# EAGLE design farbsort (EAGLE 7.6.0)
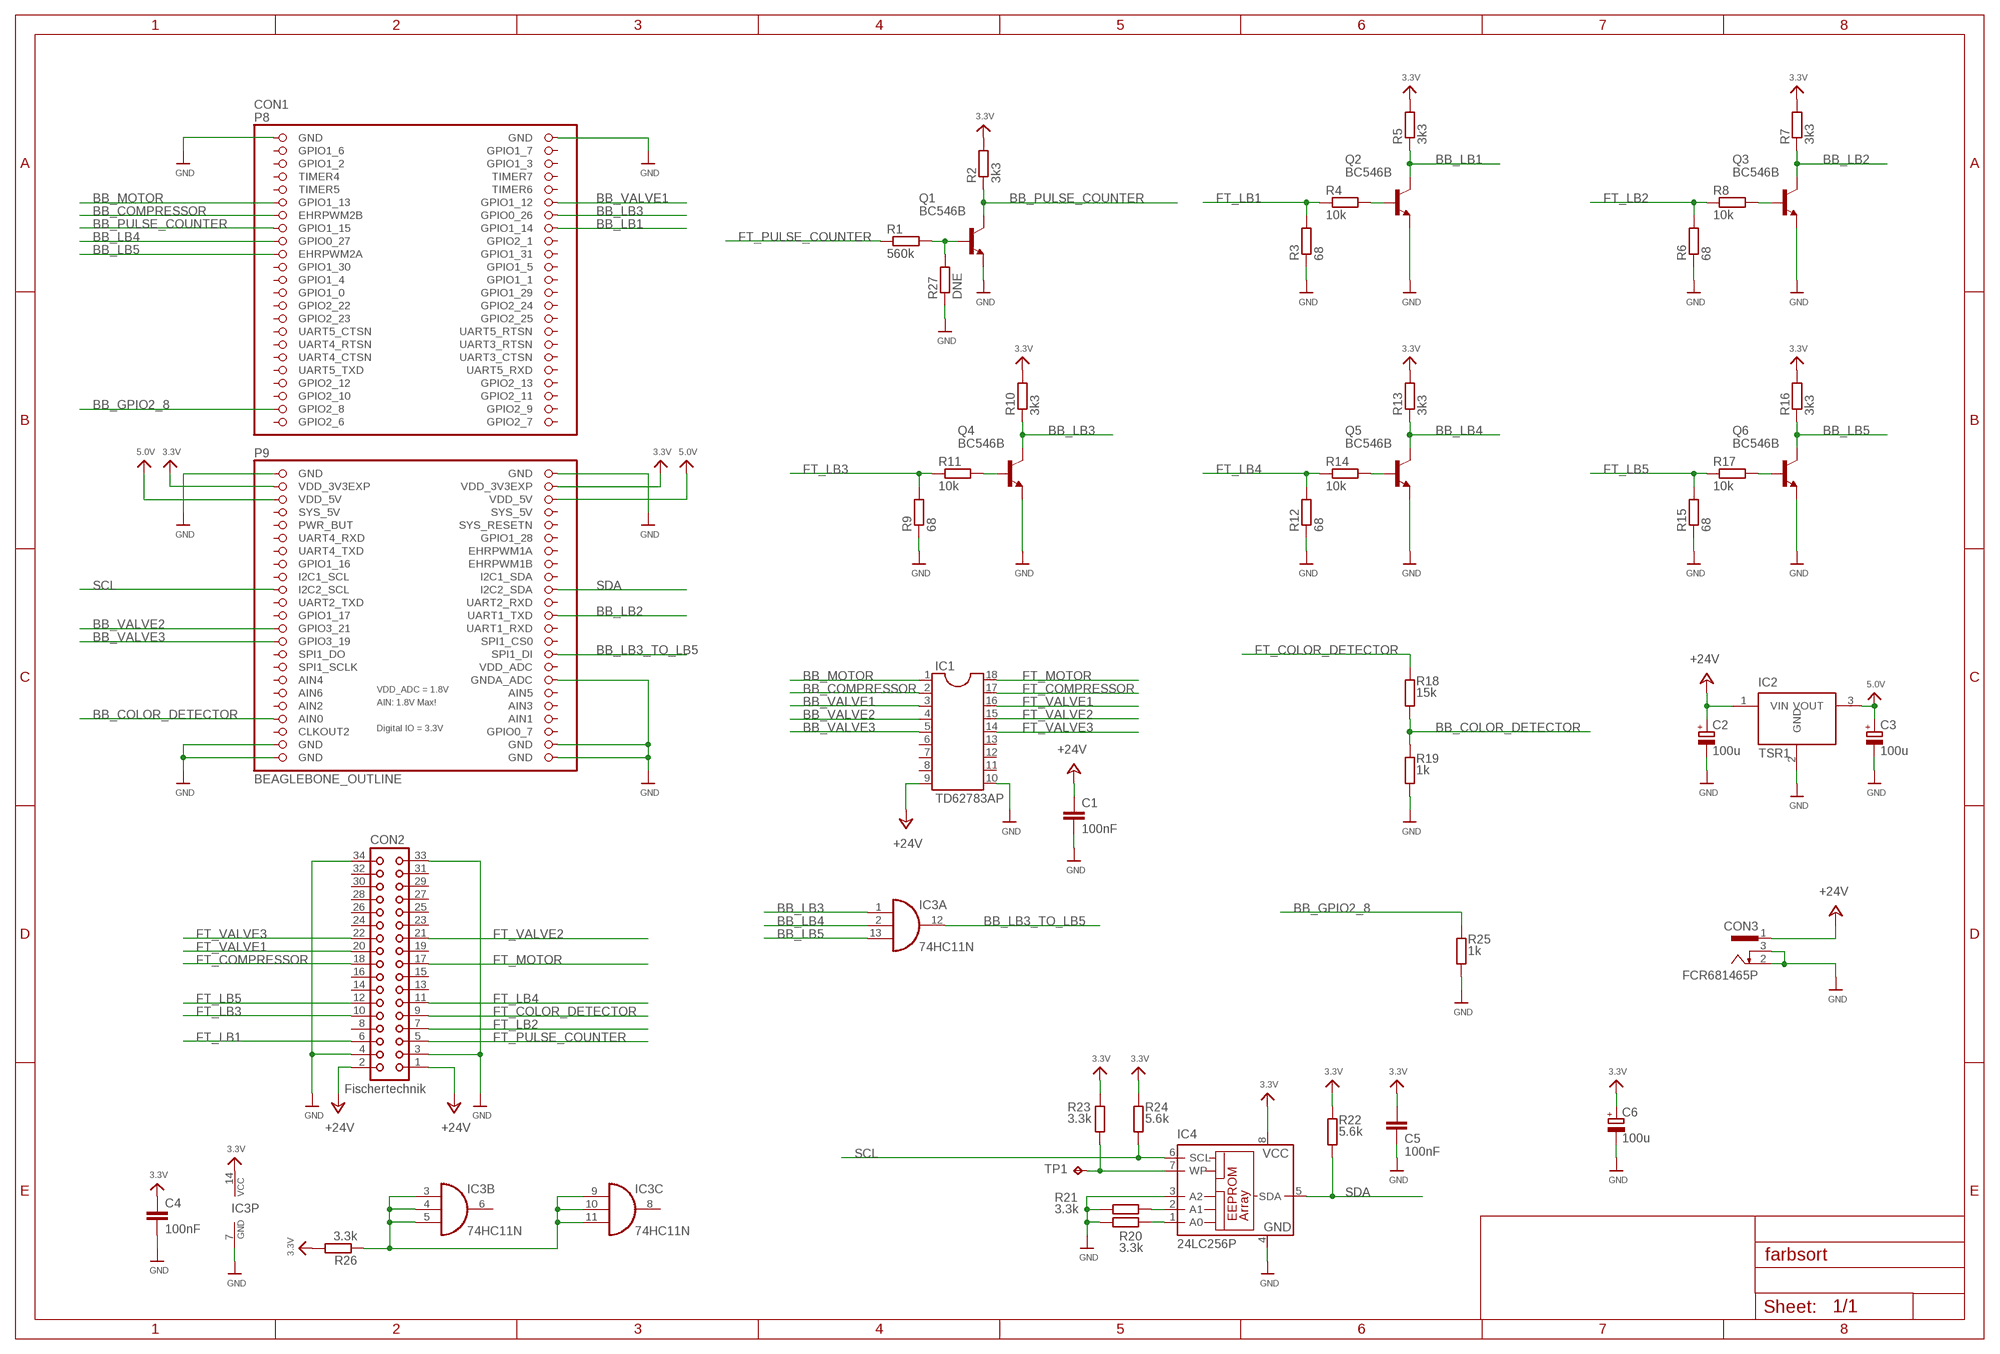
[diagram p0: schematic, sheet 1]

## Parts
C1  100nF  C-EU025-024X044  [C025-024X044]
C2  100u  CPOL-EUB45181B  [B45181B]
C3  100u  CPOL-EUB45181B  [B45181B]
C4  100nF  C-EU025-024X044  [C025-024X044]
C5  100nF  C-EU025-024X044  [C025-024X044]
C6  100u  CPOL-EUB45181B  [B45181B]
CON1  BEAGLEBONE_OUTLINE  [BEAGLEBONE_SHIELD]
CON2  Fischertechnik  CON34  [CON34]
CON3  FCR681465P  SCD-014A  [SCD-014-A]
IC1  TD62783AP  DIL18  [DIL18]
IC2  TSR1  [TSR1]
IC3  74HC11N  [DIL14]
IC4  24LC256P  [DIL8]
Q1  BC546B  [TO92-EBC]
Q2  BC546B  [TO92-EBC]
Q3  BC546B  [TO92-EBC]
Q4  BC546B  [TO92-EBC]
Q5  BC546B  [TO92-EBC]
Q6  BC546B  [TO92-EBC]
R1  560k  R-EU_0204/2V  [0204V]
R2  3k3  R-EU_0204/2V  [0204V]
R3  68  R-EU_0204/2V  [0204V]
R4  10k  R-EU_0204/2V  [0204V]
R5  3k3  R-EU_0204/2V  [0204V]
R6  68  R-EU_0204/2V  [0204V]
R7  3k3  R-EU_0204/2V  [0204V]
R8  10k  R-EU_0204/2V  [0204V]
R9  68  R-EU_0204/2V  [0204V]
R10  3k3  R-EU_0204/2V  [0204V]
R11  10k  R-EU_0204/2V  [0204V]
R12  68  R-EU_0204/2V  [0204V]
R13  3k3  R-EU_0204/2V  [0204V]
R14  10k  R-EU_0204/2V  [0204V]
R15  68  R-EU_0204/2V  [0204V]
R16  3k3  R-EU_0204/2V  [0204V]
R17  10k  R-EU_0204/2V  [0204V]
R18  15k  R-EU_0204/2V  [0204V]
R19  1k  R-EU_0204/2V  [0204V]
R20  3.3k  R-EU_0204/2V  [0204V]
R21  3.3k  R-EU_0204/2V  [0204V]
R22  5.6k  R-EU_0204/2V  [0204V]
R23  3.3k  R-EU_0204/2V  [0204V]
R24  5.6k  R-EU_0204/2V  [0204V]
R25  1k  R-EU_0204/2V  [0204V]
R26  3.3k  R-EU_0204/2V  [0204V]
R27  DNE  R-EU_0204/2V  [0204V]
TP1  TPB1,27  [B1,27]

## Nets
3.3V: C4.1 C5.1 C6.+ CON1.49(VDD_3V3EXP) CON1.50(VDD_3V3EXP) IC3.14(P:VCC) IC4.8(VCC) R2.2 R5.2 R7.2 R10.2 R13.2 R16.2 R22.1 R23.1 R24.1 R26.2
5.0V: C3.+ CON1.51(VDD_5V) CON1.52(VDD_5V) IC2.3(VOUT)
+24V: C1.1 C2.+ CON2.1 CON2.2 CON3.1 IC1.9 IC2.1(VIN)
BB_COLOR_DETECTOR: CON1.85(AIN0) R18.2 R19.1
BB_COMPRESSOR: CON1.13(EHRPWM2B) IC1.2
BB_GPIO2_8: CON1.43(GPIO2_8) R25.1
BB_LB1: CON1.16(GPIO1_14) Q2.C R5.1
BB_LB2: CON1.70(UART1_TXD) Q3.C R7.1
BB_LB3: CON1.14(GPIO0_26) IC3.1(A:I0) Q4.C R10.1
BB_LB3_TO_LB5: CON1.76(SPI1_DI) IC3.12(A:O)
BB_LB4: CON1.17(GPIO0_27) IC3.2(A:I1) Q5.C R13.1
BB_LB5: CON1.19(EHRPWM2A) IC3.13(A:I2) Q6.C R16.1
BB_MOTOR: CON1.11(GPIO1_13) IC1.1
BB_PULSE_COUNTER: CON1.15(GPIO1_15) Q1.C R2.1
BB_VALVE1: CON1.12(GPIO1_12) IC1.3
BB_VALVE2: CON1.71(GPIO3_21) IC1.4
BB_VALVE3: CON1.73(GPIO3_19) IC1.5
FT_COLOR_DETECTOR: CON2.9 R18.1
FT_COMPRESSOR: CON2.18 IC1.17
FT_LB1: CON2.6 R3.2 R4.1
FT_LB2: CON2.7 R6.2 R8.1
FT_LB3: CON2.10 R9.2 R11.1
FT_LB4: CON2.11 R12.2 R14.1
FT_LB5: CON2.12 R15.2 R17.1
FT_MOTOR: CON2.17 IC1.18
FT_PULSE_COUNTER: CON2.5 R1.1
FT_VALVE1: CON2.20 IC1.16
FT_VALVE2: CON2.21 IC1.15
FT_VALVE3: CON2.22 IC1.14
GND: C1.2 C2.- C3.- C4.2 C5.2 C6.- CON1.1(GND) CON1.2(GND) CON1.47(GND) CON1.48(GND) CON1.80(GNDA_ADC) CON1.89(GND) CON1.90(GND) CON1.91(GND) CON1.92(GND) CON2.3 CON2.4 CON2.33 CON2.34 CON3.2 CON3.3 IC1.10 IC2.2(GND) IC3.7(P:GND) IC4.3(A2) IC4.4(GND) Q1.E Q2.E Q3.E Q4.E Q5.E Q6.E R3.1 R6.1 R9.1 R12.1 R15.1 R19.2 R20.1 R21.1 R25.2 R27.1
N$1: Q1.B R1.2 R27.2
N$2: IC3.3(B:I0) IC3.4(B:I1) IC3.5(B:I2) IC3.9(C:I0) IC3.10(C:I1) IC3.11(C:I2) R26.1
N$3: Q2.B R4.2
N$6: IC4.7(WP) R23.2 TP1.TP
N$8: Q3.B R8.2
N$10: IC4.2(A1) R21.2
N$11: IC4.1(A0) R20.2
N$12: Q4.B R11.2
N$16: Q5.B R14.2
N$20: Q6.B R17.2
SCL: CON1.65(I2C2_SCL) IC4.6(SCL) R24.2
SDA: CON1.66(I2C2_SDA) IC4.5(SDA) R22.2
Unconnected: CON1.3(GPIO1_6) CON1.4(GPIO1_7) CON1.5(GPIO1_2) CON1.6(GPIO1_3) CON1.7(TIMER4) CON1.8(TIMER7) CON1.9(TIMER5) CON1.10(TIMER6) CON1.18(GPIO2_1) CON1.20(GPIO1_31) CON1.21(GPIO1_30) CON1.22(GPIO1_5) CON1.23(GPIO1_4) CON1.24(GPIO1_1) CON1.25(GPIO1_0) CON1.26(GPIO1_29) CON1.27(GPIO2_22) CON1.28(GPIO2_24) CON1.29(GPIO2_23) CON1.30(GPIO2_25) CON1.31(UART5_CTSN) CON1.32(UART5_RTSN) CON1.33(UART4_RTSN) CON1.34(UART3_RTSN) CON1.35(UART4_CTSN) CON1.36(UART3_CTSN) CON1.37(UART5_TXD) CON1.38(UART5_RXD) CON1.39(GPIO2_12) CON1.40(GPIO2_13) CON1.41(GPIO2_10) CON1.42(GPIO2_11) CON1.44(GPIO2_9) CON1.45(GPIO2_6) CON1.46(GPIO2_7) CON1.55(PWR_BUT) CON1.56(SYS_RESETN) CON1.57(UART4_RXD) CON1.58(GPIO1_28) CON1.59(UART4_TXD) CON1.60(EHRPWM1A) CON1.61(GPIO1_16) CON1.62(EHRPWM1B) CON1.63(I2C1_SCL) CON1.64(I2C1_SDA) CON1.67(UART2_TXD) CON1.68(UART2_RXD) CON1.69(GPIO1_17) CON1.72(UART1_RXD) CON1.74(SPI1_CS0) CON1.75(SPI1_DO) CON1.77(SPI1_SCLK) CON1.79(AIN4) CON1.81(AIN6) CON1.82(AIN5) CON1.83(AIN2) CON1.84(AIN3) CON1.86(AIN1) CON1.87(CLKOUT2) CON1.88(GPIO0_7) CON2.8 CON2.13 CON2.14 CON2.15 CON2.16 CON2.19 CON2.23 CON2.24 CON2.25 CON2.26 CON2.27 CON2.28 CON2.29 CON2.30 CON2.31 CON2.32 IC1.6 IC1.7 IC1.8 IC1.11 IC1.12 IC1.13 IC3.6(B:O) IC3.8(C:O)

## Power pins joined to a net without a drawn wire
SYS_5V: CON1.53(SYS_5V) CON1.54(SYS_5V)
VDD_ADC: CON1.78(VDD_ADC)

## Library data of the parts
C1 C4 C5 = resistor:C-EU: CAPACITOR, European symbol
C2 C3 C6 = resistor:CPOL-EU: POLARIZED CAPACITOR, European symbol
CON1 = microbuilder:BEAGLEBONE_OUTLINE
CON2 = con-harting:CON34: CONNECTOR; OC_FARNELL: unknown; OC_NEWARK: unknown
CON3 = con-shiua-chyuan:SCD-014A: Power Jack 2.5mm; OC_FARNELL: unknown; OC_NEWARK: unknown
IC1 = ic-package:DIL18: Dual In Line / Socket
IC2 = traco-electronic:TSR1: DC/DC Converter TSR-1 Series, 1A Source: Distrelec
IC3 = 74xx-eu:74*11: Triple 3-input AND gate
IC4 = microchip:24*: Serial EEPROM I2C; MF: MICROCHIP; MPN: 24LC256-E/P; OC_FARNELL: 9757970; OC_NEWARK: 92C7169
Q1-Q6 = transistor-npn:BC546*: NPN Transistor
R1-R27 = rcl:R-EU_: RESISTOR, European symbol
TP1 = testpad:TP: Test pad

## Board
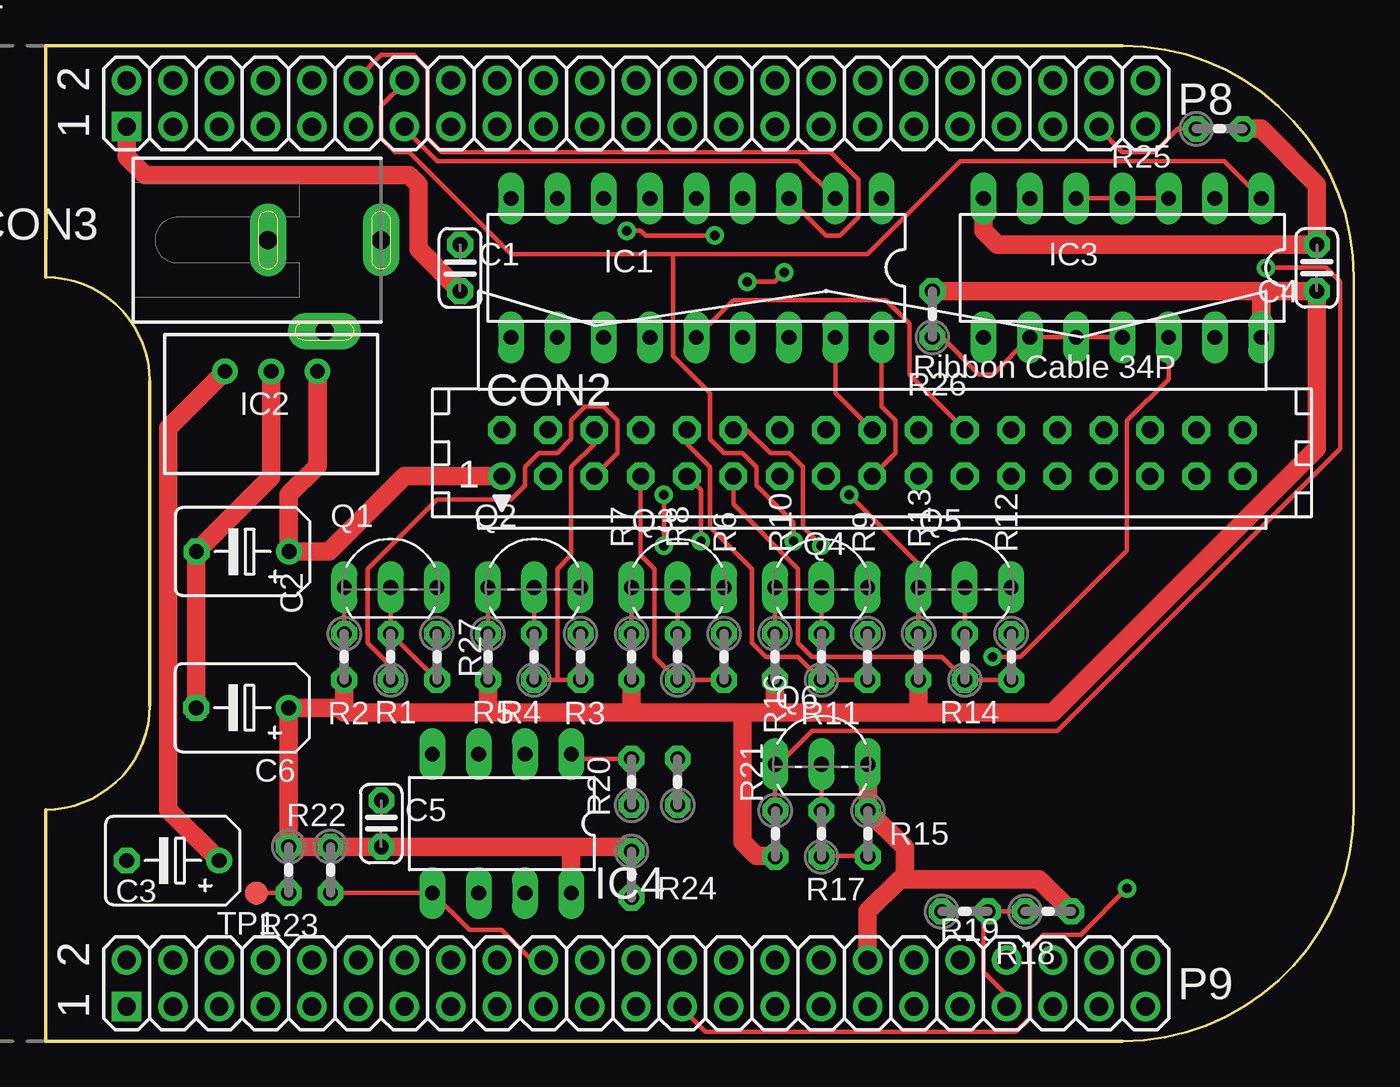
[diagram p1: board, top side]
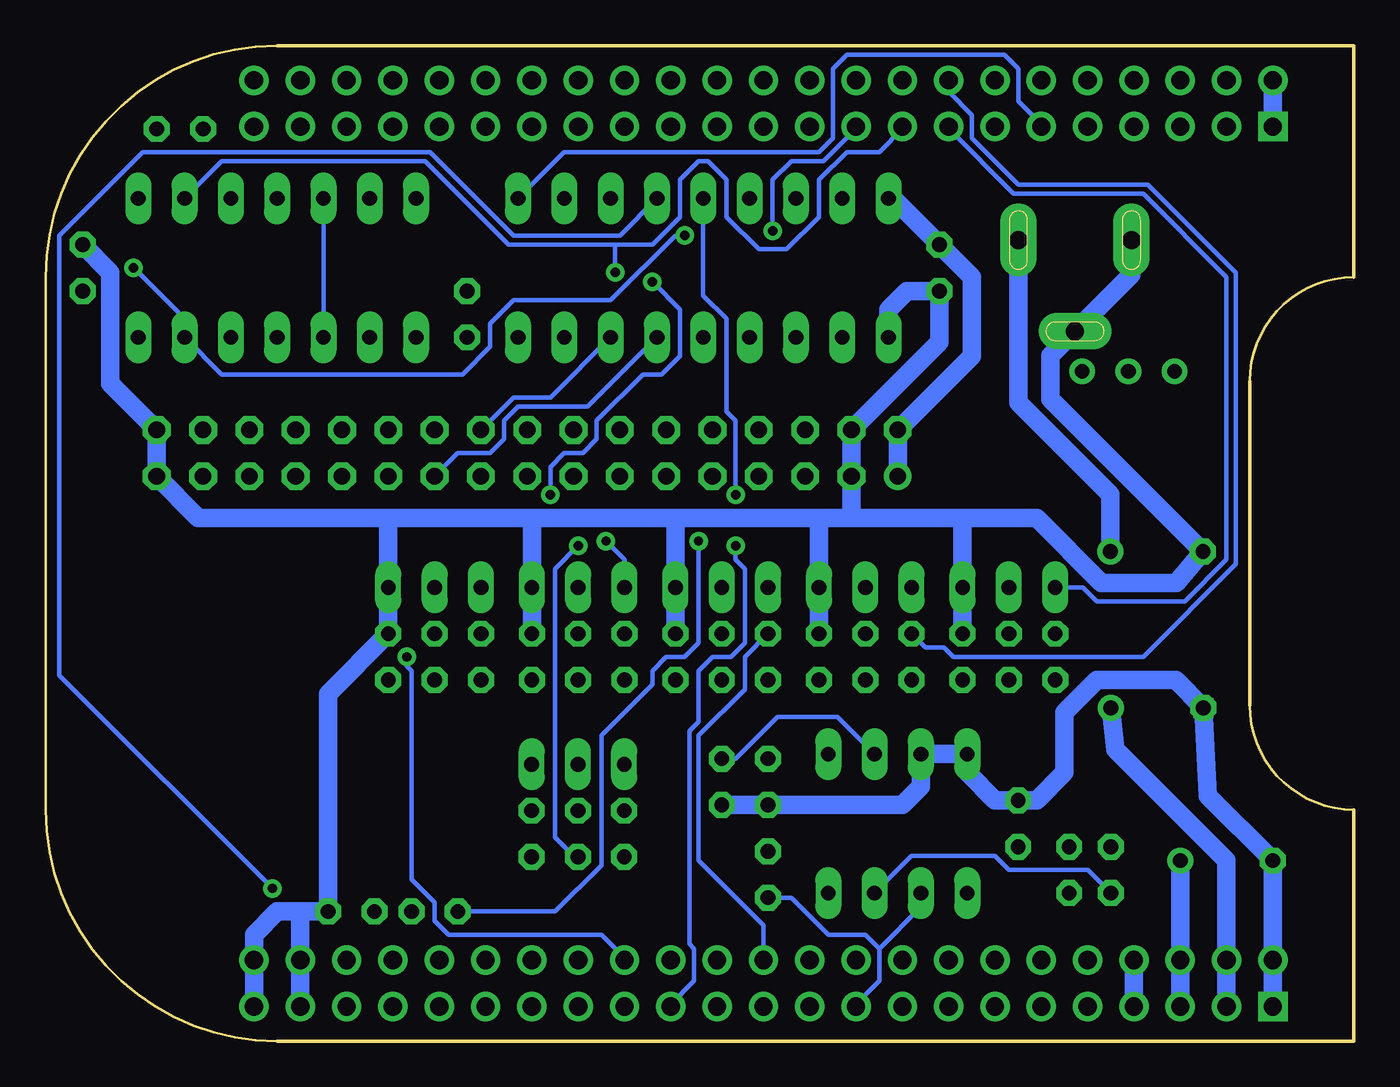
[diagram p2: board, bottom side, seen from below]

Size 71.75 x 54.61 mm. Coordinates in mm from the lower left corner, seen from the top.
Copper layers (1*16): Top 0.035mm / dielectric 1.5mm / Bottom 0.035mm
Design rules "SparkFun10mil *": minimum track width 10mil, minimum drill 20mil, track to track 10mil, track to pad 10mil, pad to pad 10mil, via to via 10mil, smd to smd 10mil, copper to edge 10mil, drill to drill 10mil, minimum pad ring 12mil, minimum via ring 10mil, stop-mask expansion 4mil, vias tented up to drill 12mil, thermal gap 10mil

### Footprints (pad centres in the part's own frame; a part is rotated, then mirrored left to right if it is on the bottom)
C025-024X044 = drill 0.813 octagon: 1 -1.27,0; 2 1.27,0
B45181B = drill 0.813: + -2.54,0 | drill 0.813 octagon: - 2.54,0
BEAGLEBONE_SHIELD = drill 1 square: 1 4.445,19.05; 47 52.705,19.05 | drill 1: 2 1.905,19.05; 3 4.445,21.59; 4 1.905,21.59; 5 4.445,24.13; 6 1.905,24.13; 7 4.445,26.67; 8 1.905,26.67; 9 4.445,29.21; 10 1.905,29.21; 11 4.445,31.75; 12 1.905,31.75; 13 4.445,34.29; 14 1.905,34.29; 15 4.445,36.83; 16 1.905,36.83; 17 4.445,39.37; 18 1.905,39.37; 19 4.445,41.91; 20 1.905,41.91; 21 4.445,44.45; 22 1.905,44.45; 23 4.445,46.99; 24 1.905,46.99; 25 4.445,49.53; 26 1.905,49.53; 27 4.445,52.07; 28 1.905,52.07; 29 4.445,54.61; 30 1.905,54.61; 31 4.445,57.15; 32 1.905,57.15; 33 4.445,59.69; 34 1.905,59.69; 35 4.445,62.23; 36 1.905,62.23; 37 4.445,64.77; 38 1.905,64.77; 39 4.445,67.31; 40 1.905,67.31; 41 4.445,69.85; 42 1.905,69.85; 43 4.445,72.39; 44 1.905,72.39; 45 4.445,74.93; 46 1.905,74.93; 48 50.165,19.05; 49 52.705,21.59; 50 50.165,21.59; 51 52.705,24.13; 52 50.165,24.13; 53 52.705,26.67; 54 50.165,26.67; 55 52.705,29.21; 56 50.165,29.21; 57 52.705,31.75; 58 50.165,31.75; 59 52.705,34.29; 60 50.165,34.29; 61 52.705,36.83; 62 50.165,36.83; 63 52.705,39.37; 64 50.165,39.37; 65 52.705,41.91; 66 50.165,41.91; 67 52.705,44.45; 68 50.165,44.45; 69 52.705,46.99; 70 50.165,46.99; 71 52.705,49.53; 72 50.165,49.53; 73 52.705,52.07; 74 50.165,52.07; 75 52.705,54.61; 76 50.165,54.61; 77 52.705,57.15; 78 50.165,57.15; 79 52.705,59.69; 80 50.165,59.69; 81 52.705,62.23; 82 50.165,62.23; 83 52.705,64.77; 84 50.165,64.77; 85 52.705,67.31; 86 50.165,67.31; 87 52.705,69.85; 88 50.165,69.85; 89 52.705,72.39; 90 50.165,72.39; 91 52.705,74.93; 92 50.165,74.93
CON34 = drill 0.914: 1 -20.32,-1.27 | drill 0.914 octagon: 2 -20.32,1.27; 3 -17.78,-1.27; 4 -17.78,1.27; 5 -15.24,-1.27; 6 -15.24,1.27; 7 -12.7,-1.27; 8 -12.7,1.27; 9 -10.16,-1.27; 10 -10.16,1.27; 11 -7.62,-1.27; 12 -7.62,1.27; 13 -5.08,-1.27; 14 -5.08,1.27; 15 -2.54,-1.27; 16 -2.54,1.27; 17 0,-1.27; 18 0,1.27; 19 2.54,-1.27; 20 2.54,1.27; 21 5.08,-1.27; 22 5.08,1.27; 23 7.62,-1.27; 24 7.62,1.27; 25 10.16,-1.27; 26 10.16,1.27; 27 12.7,-1.27; 28 12.7,1.27; 29 15.24,-1.27; 30 15.24,1.27; 31 17.78,-1.27; 32 17.78,1.27; 33 20.32,-1.27; 34 20.32,1.27
SCD-014-A = drill 1 pad 2 long: 1 0,13.7; 2 0,7.5; 3 5,10.6
DIL18 = drill 0.813 long: 1 -10.16,-3.81; 2 -7.62,-3.81; 3 -5.08,-3.81; 4 -2.54,-3.81; 5 0,-3.81; 6 2.54,-3.81; 7 5.08,-3.81; 8 7.62,-3.81; 9 10.16,-3.81; 10 10.16,3.81; 11 7.62,3.81; 12 5.08,3.81; 13 2.54,3.81; 14 0,3.81; 15 -2.54,3.81; 16 -5.08,3.81; 17 -7.62,3.81; 18 -10.16,3.81
TSR1 = drill 0.8 pad 1.2: 1 0,0; 2 2.54,0; 3 5.08,0
DIL14 = drill 0.813 long: 1 -7.62,-3.81; 2 -5.08,-3.81; 3 -2.54,-3.81; 4 0,-3.81; 5 2.54,-3.81; 6 5.08,-3.81; 7 7.62,-3.81; 8 7.62,3.81; 9 5.08,3.81; 10 2.54,3.81; 11 0,3.81; 12 -2.54,3.81; 13 -5.08,3.81; 14 -7.62,3.81
DIL8 = drill 0.813 long: 1 -3.81,-3.81; 2 -1.27,-3.81; 3 1.27,-3.81; 4 3.81,-3.81; 5 3.81,3.81; 6 1.27,3.81; 7 -1.27,3.81; 8 -3.81,3.81
TO92-EBC = drill 0.813 long: B 0,-1.27; C -2.54,-1.27; E 2.54,-1.27
0204V = drill 0.813 octagon: 1 -1.27,0; 2 1.27,0
B1,27 = smd 1.27 x 1.27: TP 0,0

### Placement (x,y rotation side)
C1  22.73,42.42 270 top
C2  10.82,26.85 180 top
C3  6.98,9.91 180 top
C4  69.72,42.42 90 top
C5  18.42,11.94 90 top
C6  10.79,18.29 180 top
CON1  -14.61,54.61 270 top
CON2  45.34,32.26 0 top
CON3  4.7,43.94 270 top
IC1  35.69,42.42 180 top
IC2  14.91,36.74 180 top
IC3  59.05,42.42 180 top
IC4  25.02,11.94 180 top
Q1  18.92,26.16 0 top
Q2  26.8,26.16 0 top
Q3  34.67,26.16 0 top
Q4  42.55,26.16 0 top
Q5  50.42,26.16 0 top
Q6  42.56,16.46 0 top
R1  18.92,21.08 90 top
R2  16.38,21.08 270 top
R3  29.34,21.08 270 top
R4  26.8,21.08 90 top
R5  24.26,21.08 270 top
R6  37.21,21.08 270 top
R7  32.13,21.08 270 top
R8  34.67,21.08 90 top
R9  45.08,21.08 270 top
R10  40,21.08 270 top
R11  42.55,21.08 90 top
R12  52.96,21.08 270 top
R13  47.88,21.08 270 top
R14  50.42,21.08 90 top
R15  45.1,11.38 270 top
R16  40.02,11.38 270 top
R17  42.56,11.38 90 top
R18  50.42,7.11 0 top
R19  54.99,7.11 0 top
R20  32.13,14.22 90 top
R21  34.67,14.22 90 top
R22  15.62,9.4 270 top
R23  13.34,9.4 270 top
R24  32.13,9.14 270 top
R25  64.39,50.04 0 top
R26  48.64,39.88 90 top
R27  21.46,21.08 270 top
TP1  11.56,8.13 0 top

### Tracks (layer width: path | path; a pad name or v marks a point on that pad's centre or on a via)
3.3V
  Top 1.016: 17.65,10.67 C5.1 | R24.1 31.88,10.67 28.83,10.67 | 28.83,10.67 C5.1 | IC4.8 28.83,10.67 | R26.2 66.67,41.15 | 66.67,41.15 C4.1 69.72,32.51 55.24,18.03 47.88,18.03 | IC3.14 66.67,41.15 | C5.1 R22.1 R23.1 13.08,10.92 13.34,11.18 C6.+ 16.13,18.29 16.38,18.03 | 47.88,18.03 39.75,18.03 | 39.75,18.03 38.23,18.03 | 38.23,18.03 32.13,18.03 | 32.13,18.03 24.26,18.03 | R10.2 40,18.29 39.75,18.03 | R7.2 32.13,18.03 | R5.2 24.26,18.03 | R2.2 16.38,18.03 | R13.2 47.88,18.03 | R16.2 39.97,10.16 38.99,10.16 38.23,10.92 38.23,18.03 | 16.38,18.03 24.26,18.03
  Bottom 1.016: CON1.49 CON1.50 6.98,9.91 13.08,16 C6.+
5.0V
  Top 1.016: IC2.3 6.73,33.64 6.73,12.7 C3.+
  Bottom 1.016: CON1.51 CON1.52 C3.+
+24V
  Top 1.016: IC2.1 14.91,31.55 13.34,29.97 13.34,26.87 C2.+ | 13.17,26.92 C2.+ | CON2.1 19.68,30.99 15.55,26.85 C2.+
  Bottom 1.016: CON2.1 CON2.2 20.96,37.59 20.96,41.91 C1.1 25.27,46.23 IC1.9 | CON3.1 18.4,35.04 13.36,29.99 C2.+
BB_COLOR_DETECTOR
  Top 0.254: R19.1 R18.2 51.44,6.86 51.44,3.81 52.7,2.54 CON1.85
BB_COMPRESSOR
  Top 0.254: IC1.2 41.28,48.26 21.46,48.26 19.68,50.04 CON1.13
BB_GPIO2_8
  Top 0.254: R25.1 62.1,50.04 60.83,48.77 59.05,48.77 57.78,50.04 CON1.43
BB_LB1
  Top 0.254: Q2.C R5.1
  Bottom 0.254: CON1.16 22.22,52.07 20.96,50.8 20.96,49.53 18.42,46.99 11.3,46.99 6.48,42.16 6.48,26.16 11.56,21.08 21.97,21.08 22.48,21.59 23.5,21.59 R5.1
BB_LB2
  Top 0.254: Q3.C R7.1
  Bottom 0.254: CON1.70 32.39,6.35 35.94,9.91 35.94,16.76 33.4,19.3 33.4,21.08 R7.1
BB_LB3  (via drill 0.51)
  Top 0.254: Q4.C R10.1 | IC3.1 64.64,48.26 50.16,48.26 45.08,43.18 34.42,43.18 | 34.42,43.18 25.53,43.18 19.94,48.77 19.18,48.77 18.42,49.53 18.42,51.31 19.68,52.58 CON1.14 | v41.02,27.43 41.02,28.45 38.99,30.48 38.99,31.5 38.23,32.26 37.21,32.26 36.45,33.02 36.45,35.56 34.42,37.59 34.42,43.18
  Bottom 0.254: Q4.C 40,26.42 v41.02,27.43
BB_LB3_TO_LB5  (via drill 0.51)
  Top 0.254: IC3.12 61.59,36.32 59.31,34.04 59.31,26.92 53.47,21.08 v51.94,21.08
  Bottom 0.254: v51.94,21.08 51.94,20.57 51.69,20.32 51.69,8.89 50.42,7.62 50.42,6.6 49.66,5.84 41.28,5.84 40,4.57 CON1.76
BB_LB4  (via drill 0.51)
  Top 0.254: R13.1 Q5.C 47.88,26.16 v44.07,29.97 | v38.48,41.66 40,41.66 v40.51,42.16
  Bottom 0.254: IC3.2 62.1,48.26 50.93,48.26 46.36,43.69 40.51,43.69 | 40.51,43.69 38.48,43.69 36.96,45.21 36.96,47.24 35.94,48.26 35.43,48.26 34.42,47.24 34.42,45.21 32.64,43.43 31.11,43.43 29.34,45.21 29.34,47.24 27.81,48.77 26.04,48.77 24.76,50.04 CON1.17 | v44.07,29.97 44.07,31.5 43.31,32.26 42.29,32.26 41.53,33.02 41.53,34.04 38.99,36.58 37.97,36.58 36.96,37.59 36.96,40.13 v38.48,41.66 | 40.51,43.69 v40.51,42.16
BB_LB5  (via drill 0.51)
  Top 0.254: R16.1 40,12.7 40,14.99 Q6.C 40.26,15.24 42.04,17.02 55.5,17.02 70.99,32.51 70.99,41.66 70.23,42.42 v66.93,42.42 | v31.88,44.45 32.64,44.45 32.89,44.2 v36.7,44.2
  Bottom 0.254: v66.93,42.42 64.13,39.62 IC3.13 62.1,36.58 48.89,36.58 47.37,38.1 47.37,39.37 46.1,40.64 40.77,40.64 37.21,44.2 v36.7,44.2 | v31.88,44.45 31.88,47.24 30.86,48.26 29.08,48.26 27.3,50.04 CON1.19
BB_MOTOR
  Bottom 0.254: IC1.1 43.31,48.77 29.34,48.77 28.57,49.53 28.57,53.34 27.81,54.1 19.18,54.1 18.42,53.34 18.42,51.56 17.14,50.29 CON1.11
BB_PULSE_COUNTER
  Top 0.254: Q1.C R2.1
  Bottom 0.254: CON1.15 22.22,50.04 18.67,46.48 11.56,46.48 6.98,41.91 6.98,26.42 9.27,24.13 14.1,24.13 14.86,24.89 Q1.C
BB_VALVE1
  Top 0.254: IC1.3 42.8,44.2 43.56,44.2 44.58,45.21 44.58,47.24 43.05,48.77 21.72,48.77 20.96,49.53 20.96,53.34 20.19,54.1 18.42,54.1 17.14,52.83 CON1.12
BB_VALVE2  (via drill 0.51)
  Top 0.254: v59.31,8.38 56.77,5.84 54.74,5.84 53.97,5.08 53.97,1.27 53.21,0.51 36.19,0.51 34.92,1.78 CON1.71
  Bottom 0.254: IC1.4 40.26,44.2 46.1,44.2 50.67,48.77 66.42,48.77 70.99,44.2 70.99,20.07 v59.31,8.38
BB_VALVE3  (via drill 0.51)
  Top 0.254: v33.91,27.18 v33.91,29.97
  Bottom 0.254: IC1.5 35.69,40.89 34.42,39.62 34.42,34.54 33.91,34.04 v33.91,29.97 | v33.91,27.18 33.91,26.42 33.4,25.91 33.4,21.84 34.16,21.08 35.18,21.08 35.94,20.32 35.94,17.53 36.45,17.02 36.45,5.33 36.19,5.08 36.19,3.3 37.47,2.03 CON1.73
FT_COLOR_DETECTOR  (via drill 0.51)
  Top 0.254: v35.94,27.43 35.94,30.23 CON2.9
  Bottom 0.254: R18.1 43.81,7.11 41.28,9.65 41.28,16.76 38.48,19.56 38.48,20.32 37.72,21.08 36.7,21.08 35.94,21.84 v35.94,27.43
FT_COMPRESSOR
  Top 0.254: IC1.17 43.31,35.56 CON2.18
FT_LB1
  Top 0.254: R3.2 28.07,19.81 | 28.07,19.81 R4.1 | CON2.6 30.1,32.77 28.83,31.5 28.83,26.67 28.07,25.91 28.07,19.81
FT_LB2
  Top 0.254: R6.2 R8.1 33.4,21.08 33.4,25.91 32.64,26.67 CON2.7
FT_LB3
  Top 0.254: R9.2 R11.1 41.28,21.08 39.5,21.08 38.73,21.84 38.73,25.91 36.45,28.19 36.45,31.5 35.18,32.77 CON2.10
FT_LB4
  Top 0.254: R12.2 R14.1 49.15,21.08 42.04,21.08 41.28,21.84 41.28,25.91 37.72,29.46 CON2.11
FT_LB5  (via drill 0.51)
  Top 0.254: R17.1 42.8,10.16 45.08,10.16 R15.2 | CON2.12 38.48,33.53 39.75,32.26 40.77,32.26 41.53,31.5 41.53,28.19 v42.55,27.18
  Bottom 0.254: v42.55,27.18 43.81,25.91 43.81,11.18 42.8,10.16 R17.1
FT_MOTOR
  Top 0.254: IC1.18 45.85,34.8 46.61,34.04 46.61,32.26 CON2.17
FT_PULSE_COUNTER
  Top 0.254: R1.1 18.92,20.57 17.65,21.84 17.65,25.91 21.46,29.72 25.53,29.72 26.29,30.48 26.29,31.5 27.05,32.26 28.07,32.26 28.83,33.02 28.83,34.04 29.59,34.8 30.61,34.8 31.37,34.04 31.37,32.26 CON2.5
FT_VALVE1
  Bottom 0.254: IC1.16 44.07,35.31 46.1,35.31 CON2.20
FT_VALVE2
  Bottom 0.254: IC1.15 42.04,34.8 45.85,34.8 46.61,34.04 46.61,33.02 47.37,32.26 49.15,32.26 CON2.21
FT_VALVE3
  Top 0.254: IC1.14 37.72,40.64 46.1,40.64 47.37,39.37 47.37,36.58 CON2.22
GND  (via drill 0.6)
  Top 1.016: IC3.7 51.44,44.45 52.2,43.69 C4.2 69.72,46.99 66.67,50.04 R25.2 | CON1.80 45.08,7.11 46.86,8.89 47.12,8.89 | 47.12,8.89 54.48,8.89 R19.2 | Q6.E R15.1 47.12,10.63 47.12,8.89 | CON1.1 4.45,48.51 5.46,47.5 19.94,47.5 20.45,46.99 20.45,43.43 C1.2 | C6.- 8.25,26.83 C2.- 12.37,30.95 IC2.2
  Bottom 0.254: 4.45,9.65 C3.-
  Bottom 1.016: CON1.2 CON1.1 | 57.78,7.11 59.05,7.11 60.33,5.84 CON1.92 CON1.91 | 57.78,7.11 CON1.90 CON1.89 | CON1.47 CON1.48 4.45,9.65 | CON3.2 12.2,42.04 CON3.3 | CON3.3 15.11,38.94 | 52.96,28.7 63.37,28.7 CON2.33 CON2.34 68.2,36.07 68.2,42.16 C4.2 | 52.96,28.7 44.83,28.7 | 44.83,28.7 37.21,28.7 | 37.21,28.7 29.34,28.7 | 29.34,28.7 27.56,28.7 | 27.56,28.7 21.46,28.7 | IC1.10 25.53,40.13 24.51,41.15 C1.2 22.73,38.35 CON2.4 CON2.3 27.56,28.7 | R21.1 R20.1 24.76,12.95 23.75,13.97 IC4.3 IC4.4 21.21,14.73 19.68,13.21 C5.2 17.4,13.21 15.88,14.73 15.88,18.03 14.1,19.81 9.78,19.81 C6.- 8,13.46 C3.- | 57.78,7.11 R19.2 56.26,19.05 R12.1 Q5.E 52.96,28.7 | 44.83,28.7 45.08,28.45 Q4.E R9.1 | CON3.3 16.64,37.6 16.64,35.21 C2.- 9.73,25.15 13.84,25.15 17.4,28.7 21.46,28.7 | R6.1 Q3.E 37.21,28.7 | R3.1 Q2.E 29.34,28.7 | 21.46,28.7 Q1.E R27.1
  other vias: 8.25,18.29
N$1
  Top 0.254: Q1.B R1.2 R27.2
N$2
  Top 0.254: IC3.5 IC3.4 IC3.3 | R26.1 49.15,38.61 51.18,36.58 51.94,36.58 IC3.9 IC3.10 IC3.11
  Bottom 0.254: IC3.10 IC3.5
N$3
  Top 0.254: Q2.B R4.2
N$6
  Top 0.254: R23.2 TP1.TP
  Bottom 0.254: IC4.7 24.26,10.16 19.68,10.16 18.92,9.4 14.61,9.4 R23.2
N$8
  Top 0.254: Q3.B R8.2
N$10
  Bottom 0.254: R21.2 33.91,15.49 31.62,17.78 28.32,17.78 IC4.2
N$11
  Top 0.254: R20.2 29.08,15.49 IC4.1
N$12
  Top 0.254: Q4.B R11.2
N$16
  Top 0.254: Q5.B R14.2
N$20
  Top 0.254: R17.2 42.55,12.7 42.55,14.99 Q6.B
SCL
  Bottom 0.254: IC4.6 23.75,7.37 26.04,5.08 | 26.04,5.08 26.04,3.3 27.3,2.03 CON1.65 | R24.2 30.86,7.87 28.83,5.84 26.8,5.84 26.04,5.08
SDA
  Top 0.254: R22.2 IC4.5 23.24,6.1 25.02,6.1 26.54,4.57 27.3,4.57 CON1.66
SYS_5V
  Bottom 1.016: CON1.53 CON1.54

### Text on the board
tPlace: 2 | P8 | 1 | 2 | P9 | 1